# EAGLE design Lightsaber (EAGLE 9.6.2)
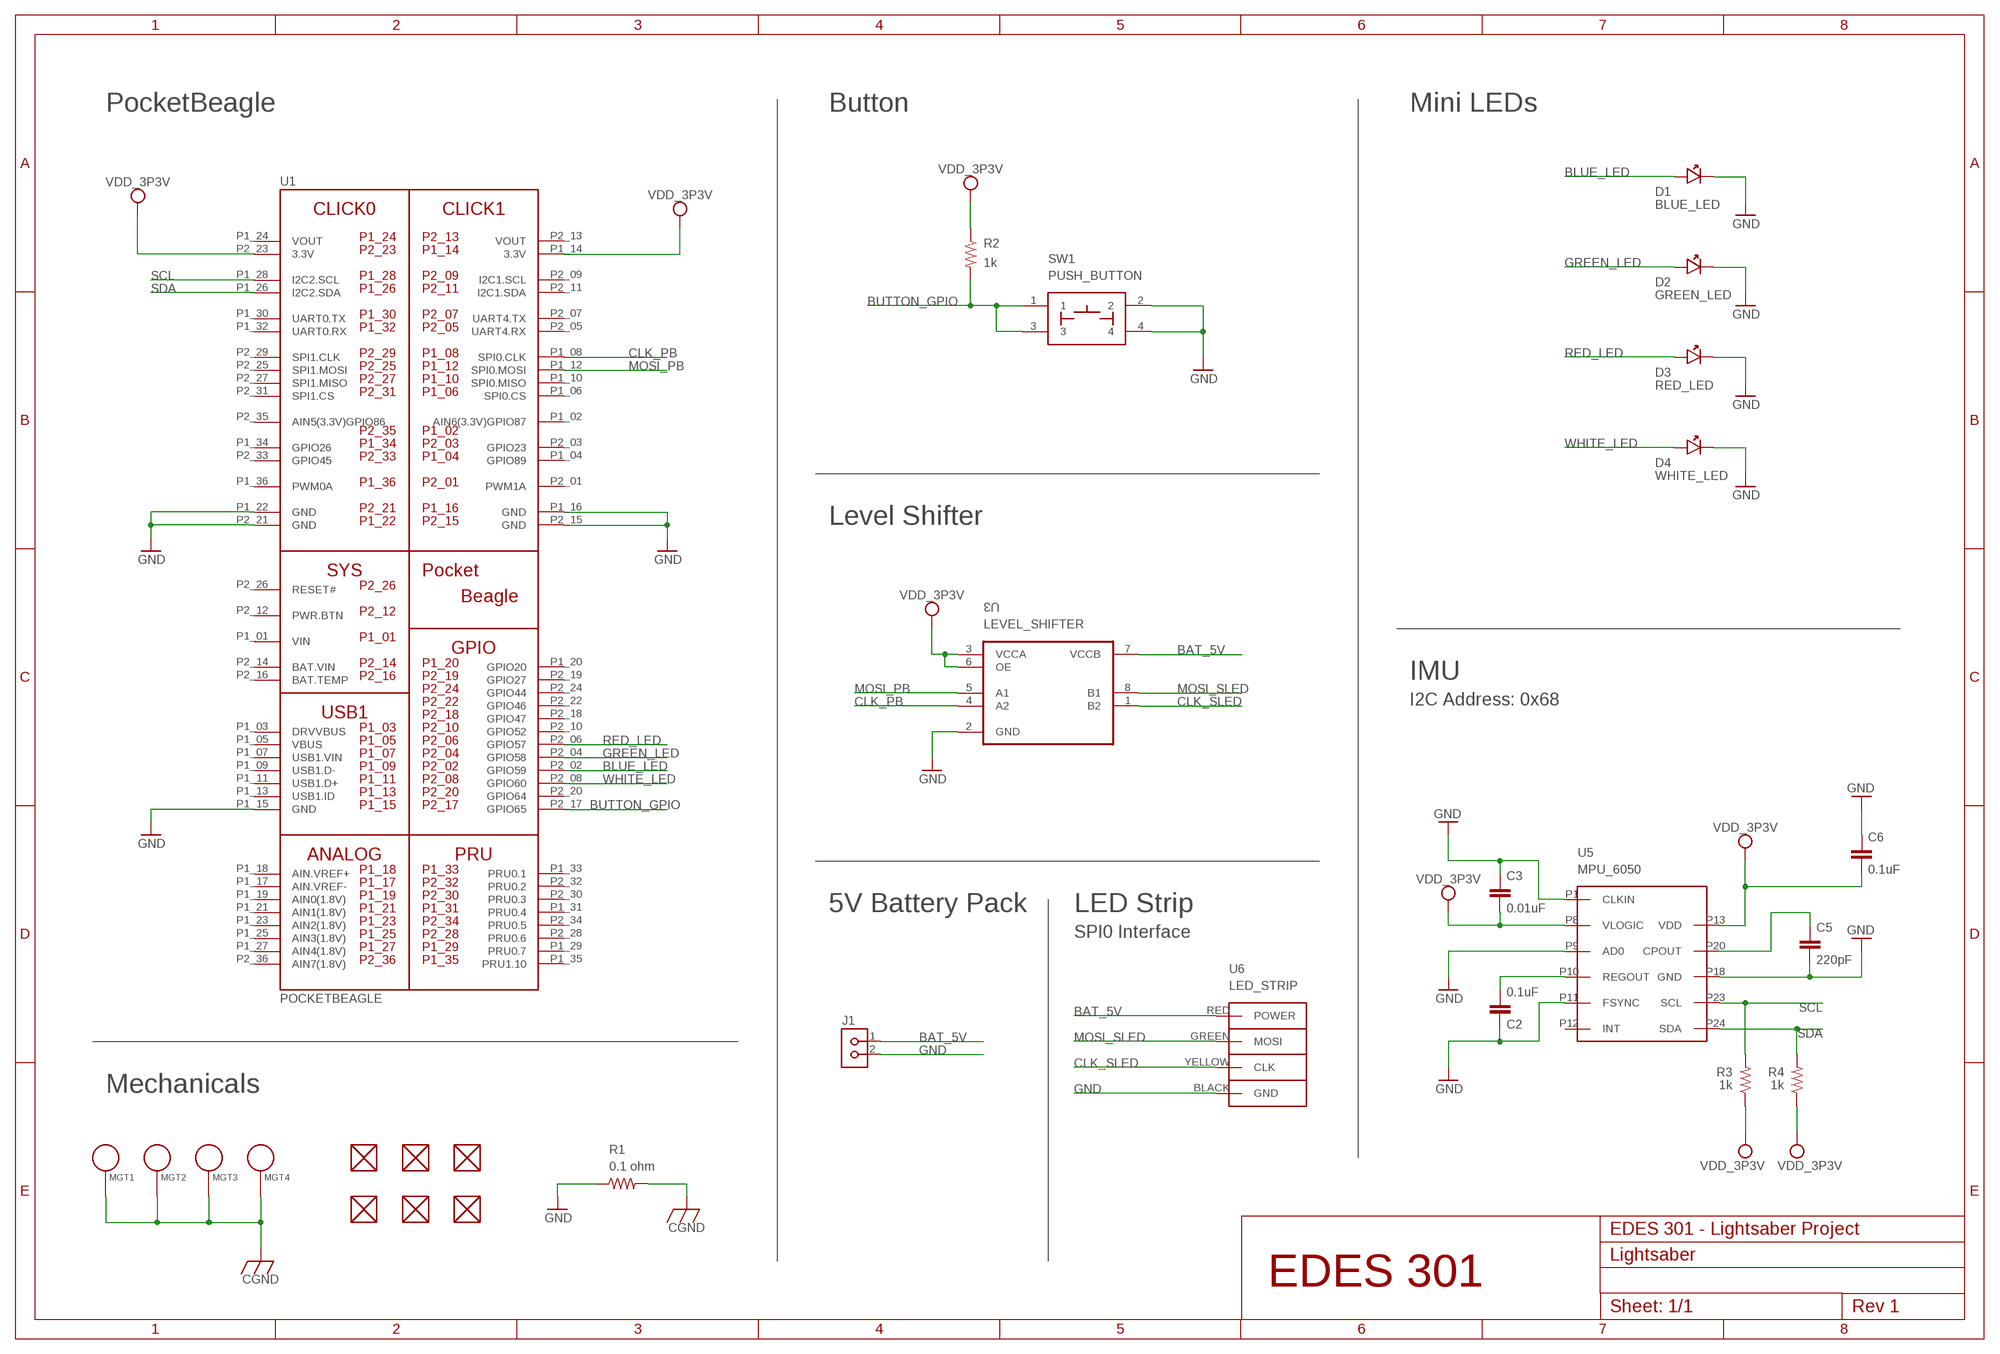
[diagram p0: schematic, sheet 1]

## Parts
C2  0.1uF  C_C0603  [C0603]
C3  0.01uF  C_C0603  [C0603]
C5  220pF  C_C0603  [C0603]
C6  0.1uF  C_C0603  [C0603]
D1  BLUE_LED  LED  [LED]
D2  GREEN_LED  LED  [LED]
D3  RED_LED  LED  [LED]
D4  WHITE_LED  LED  [LED]
FUD1  FIDUCIAL  [FIDUCIAL_40MIL]
FUD2  FIDUCIAL  [FIDUCIAL_40MIL]
FUD3  FIDUCIAL  [FIDUCIAL_40MIL]
FUD4  FIDUCIAL  [FIDUCIAL_40MIL]
FUD5  FIDUCIAL  [FIDUCIAL_40MIL]
FUD6  FIDUCIAL  [FIDUCIAL_40MIL]
J1  PINHD-1X2  [H1X2-2.54]
MGT1  MOUNTING_HOLE  [MOUNTING_HOLE]
MGT2  MOUNTING_HOLE  [MOUNTING_HOLE]
MGT3  MOUNTING_HOLE  [MOUNTING_HOLE]
MGT4  MOUNTING_HOLE  [MOUNTING_HOLE]
R1  0.1 ohm  RESISTORR0805  [R0805]
R2  1k  R_R0603  [R0603]
R3  1k  RESISTORR0603  [R0603]
R4  1k  RESISTORR0603  [R0603]
SW1  PUSH_BUTTON  [BUTTON_12.5MM]
U1  POCKETBEAGLE  [POCKETBEAGLE]
U3  LEVEL_SHIFTER  [LEVEL_SHIFTER]
U5  MPU_6050  [MPU_6050]
U6  LED_STRIP  [LED_STRIP]

## Nets
BAT_5V: J1.1 U3.7(VCCB) U6.RED(POWER)
BLUE_LED: D1.ANODE U1.P2_02(GPIO59)
BUTTON_GPIO: R2.2 SW1.1 SW1.3 U1.P2_17(GPIO65)
CGND: MGT1.P$1 MGT2.P$1 MGT3.P$1 MGT4.P$1 R1.2
CLK_PB: U1.P1_08(SPI0.CLK) U3.4(A2)
CLK_SLED: U3.1(B2) U6.YELLOW(CLK)
GND: C2.2 C3.1 C5.2 C6.1 D1.CATHODE D2.CATHODE D3.CATHODE D4.CATHODE J1.2 R1.1 SW1.2 SW1.4 U1.P1_15(GND) U1.P1_16(GND) U1.P1_22(GND) U1.P2_15(GND) U1.P2_21(GND) U3.2(GND) U5.P1(CLKIN) U5.P9(AD0) U5.P11(FSYNC) U5.P18(GND) U6.BLACK(GND)
GREEN_LED: D2.ANODE U1.P2_04(GPIO58)
MOSI_PB: U1.P1_12(SPI0.MOSI) U3.5(A1)
MOSI_SLED: U3.8(B1) U6.GREEN(MOSI)
N$3: C2.1 U5.P10(REGOUT)
N$5: C5.1 U5.P20(CPOUT)
RED_LED: D3.ANODE U1.P2_06(GPIO57)
SCL: R3.2 U1.P1_28(I2C2.SCL) U5.P23(SCL)
SDA: R4.2 U1.P1_26(I2C2.SDA) U5.P24(SDA)
VDD_3P3V: C3.2 C6.2 R2.1 R3.1 R4.1 U1.P1_14(3.3V) U1.P2_23(3.3V) U3.3(VCCA) U3.6(OE) U5.P8(VLOGIC) U5.P13(VDD)
WHITE_LED: D4.ANODE U1.P2_08(GPIO60)
Unconnected: FUD1.P$1 FUD2.P$1 FUD3.P$1 FUD4.P$1 FUD5.P$1 FUD6.P$1 U1.P1_02(AIN6(3.3V)GPIO87) U1.P1_03(DRVVBUS) U1.P1_04(GPIO89) U1.P1_05(VBUS) U1.P1_06(SPI0.CS) U1.P1_07(USB1.VIN) U1.P1_09(USB1.D-) U1.P1_10(SPI0.MISO) U1.P1_11(USB1.D+) U1.P1_13(USB1.ID) U1.P1_17(AIN.VREF-) U1.P1_18(AIN.VREF+) U1.P1_19(AIN0(1.8V)) U1.P1_20(GPIO20) U1.P1_21(AIN1(1.8V)) U1.P1_23(AIN2(1.8V)) U1.P1_25(AIN3(1.8V)) U1.P1_27(AIN4(1.8V)) U1.P1_29(PRU0.7) U1.P1_30(UART0.TX) U1.P1_31(PRU0.4) U1.P1_32(UART0.RX) U1.P1_33(PRU0.1) U1.P1_34(GPIO26) U1.P1_35(PRU1.10) U1.P1_36(PWM0A) U1.P2_01(PWM1A) U1.P2_03(GPIO23) U1.P2_05(UART4.RX) U1.P2_07(UART4.TX) U1.P2_09(I2C1.SCL) U1.P2_10(GPIO52) U1.P2_11(I2C1.SDA) U1.P2_12(PWR.BTN) U1.P2_16(BAT.TEMP) U1.P2_18(GPIO47) U1.P2_19(GPIO27) U1.P2_20(GPIO64) U1.P2_22(GPIO46) U1.P2_24(GPIO44) U1.P2_25(SPI1.MOSI) U1.P2_26(RESET#) U1.P2_27(SPI1.MISO) U1.P2_28(PRU0.6) U1.P2_29(SPI1.CLK) U1.P2_30(PRU0.3) U1.P2_31(SPI1.CS) U1.P2_32(PRU0.2) U1.P2_33(GPIO45) U1.P2_34(PRU0.5) U1.P2_35(AIN5(3.3V)GPIO86) U1.P2_36(AIN7(1.8V)) U5.P12(INT)

## Notes on the sheet
- PocketBeagle | Button | Mini LEDs
- Level Shifter
- IMU
- I2C Address: 0x68
- 5V Battery Pack | LED Strip
- SPI0 Interface
- Mechanicals
- EDES 301 - Lightsaber Project
- EDES 301
- 1/1

## Power pins joined to a net without a drawn wire
BAT.VIN: U1.P2_14(BAT.VIN)
VIN: U1.P1_01(VIN)
VOUT: U1.P1_24(VOUT) U1.P2_13(VOUT)

## Library data of the parts
C2 C3 C5 C6 = Lightsaber:C_: Capacitor SMD. Sizes: 0402, 0603 & 0805
D1-D4 = Lightsaber:LED: LTST-C191TBKT LED
FUD1-FUD6 = Lightsaber:FIDUCIAL
J1 = Lightsaber:PINHD-1X2: 2-pin 100 mil header
MGT1-MGT4 = Lightsaber:MOUNTING_HOLE: Chassis Mounting Hole w/GND connection ability
R1 R3 R4 = Lightsaber:RESISTOR: RESISTOR, American symbol
R2 = Lightsaber:R_: RESISTOR, American symbol
SW1 = Lightsaber:PUSH_BUTTON
U1 = Lightsaber:POCKETBEAGLE
U3 = Lightsaber:LEVEL_SHIFTER: Check availability <https://pricing.snapeda.com/parts/TXS0102DCTR/Texas%20Instruments/view-part?ref=eda> TXS0102DCTR; AVAILABILITY: In Stock; CHECK_PRICES: https://www.snapeda.com/parts/TXS0102DCTR/Texas+Instruments/view-part/?ref=eda; DESCRIPTION: 2-Bit Bidirectional Voltage-Level Shifter for Open-Drain and Push-Pull Application; MF: Texas Instruments; MP: TXS0102DCTR; PACKAGE: SSOP-8 Texas Instruments; PRICE: None; SNAPEDA_LINK: https://www.snapeda.com/parts/TXS0102DCTR/Texas+Instruments/view-part/?ref=snap
U5 = Lightsaber:MPU_6050: MPU 6050
U6 = Lightsaber:LED_STRIP: SK9822 LED Strip

## Board
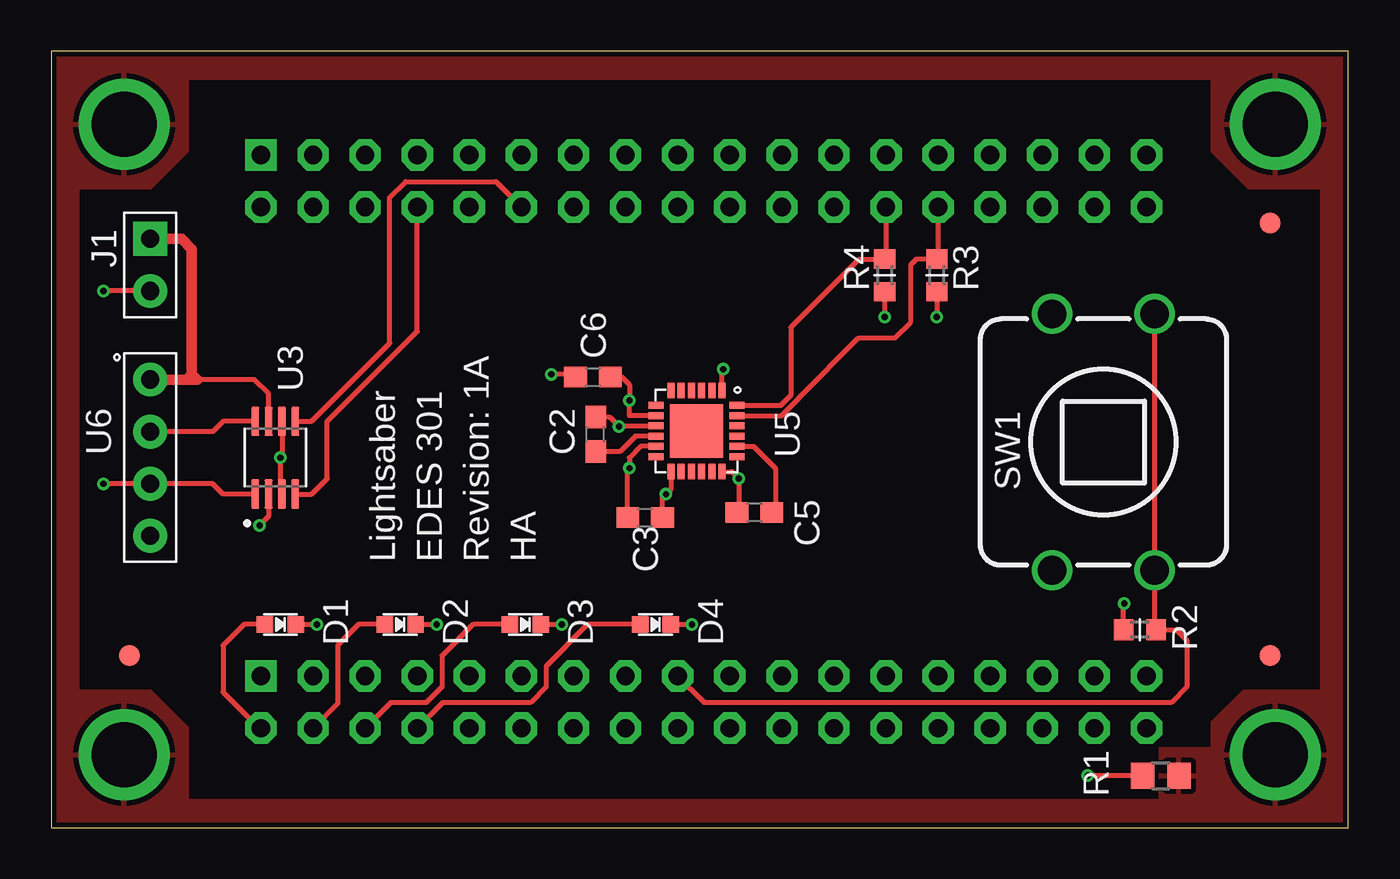
[diagram p1: board, top side]
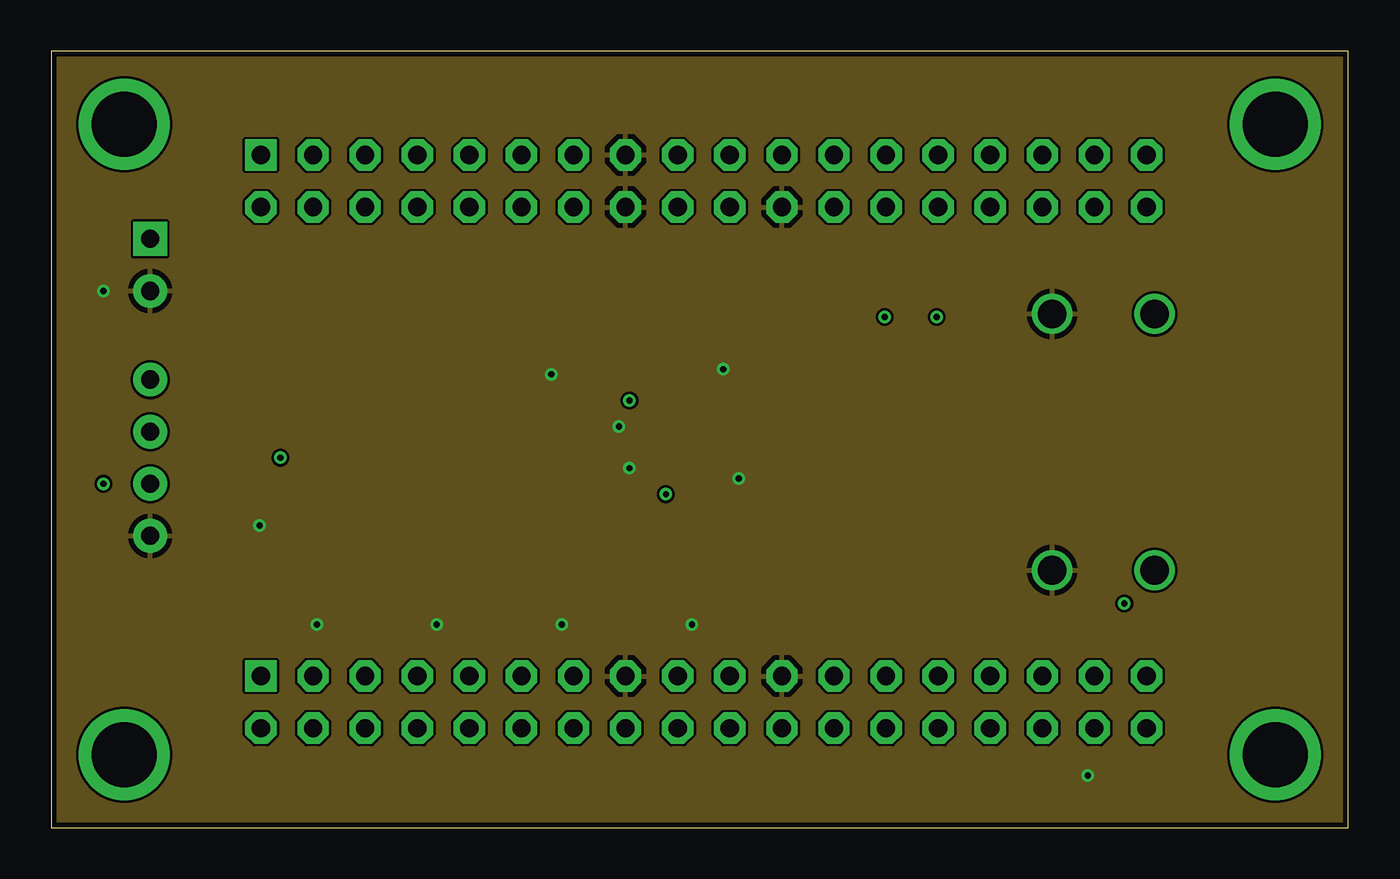
[diagram p2: board, inner layer Route2]
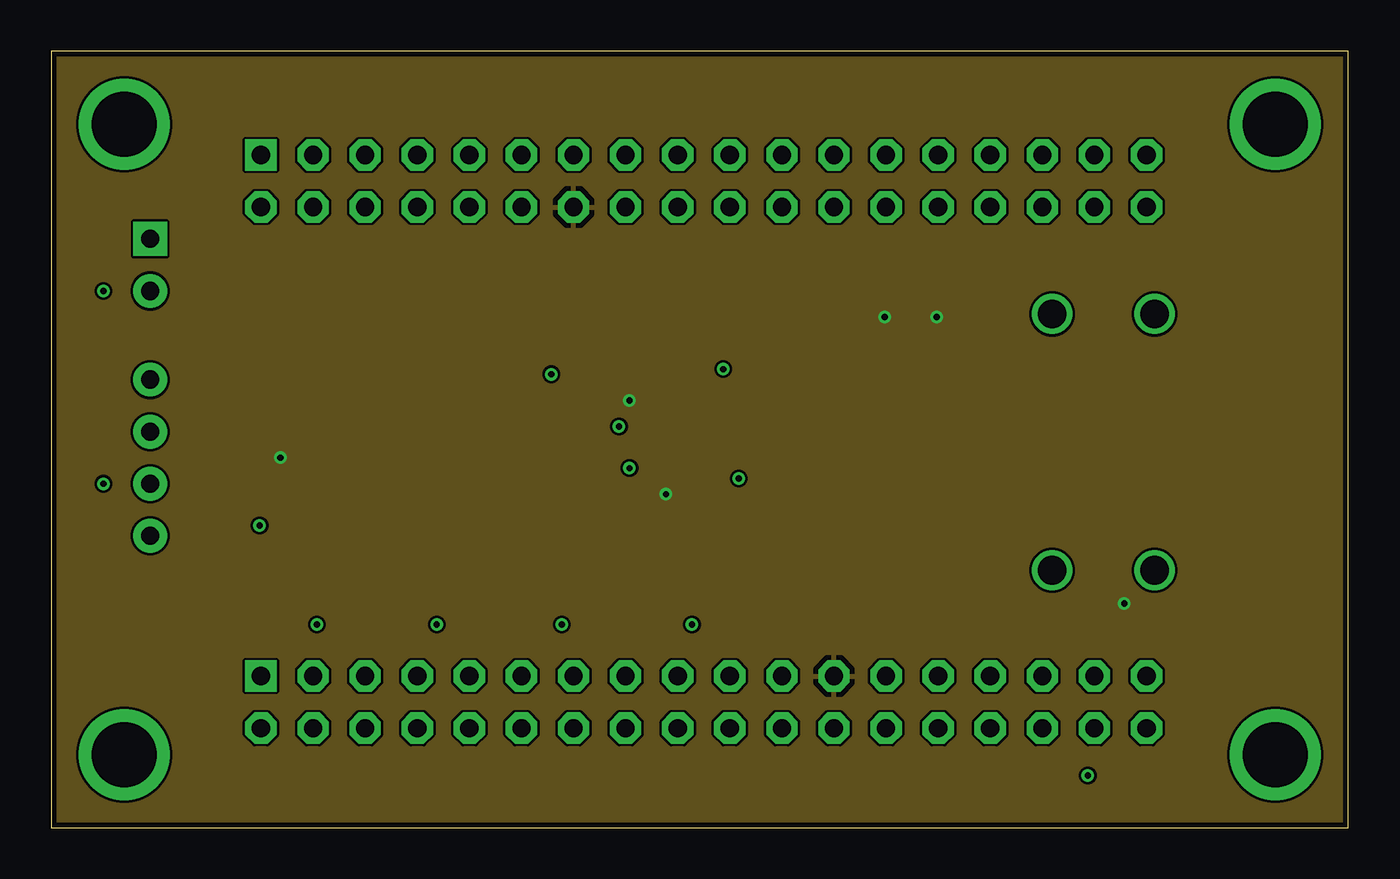
[diagram p3: board, inner layer Route15]
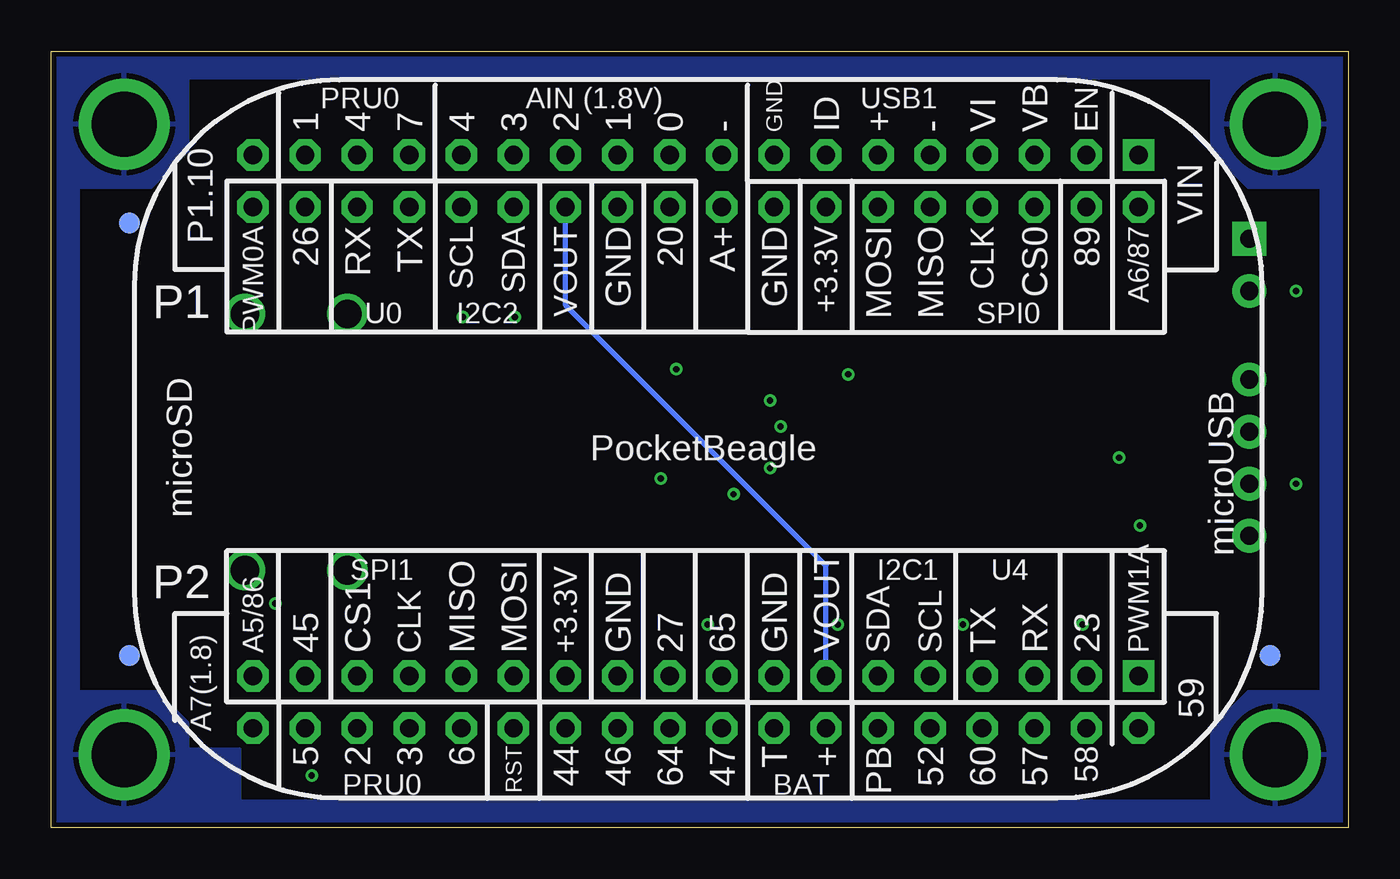
[diagram p4: board, bottom side, seen from below]

Size 63.25 x 37.85 mm. Coordinates in mm from the lower left corner, seen from the top.
Outline: 0,0 63.25,0 63.25,37.85 0,37.85 0,0
Copper layers (1*2*15*16): Top 0.035mm / dielectric 0.23mm / Route2 0.035mm / dielectric 0.93mm / Route15 0.035mm / dielectric 0.23mm / Bottom 0.035mm
Design rules "ENGI301_4lyr_5-5": minimum track width 10mil, minimum drill 12mil, track to track 5mil, track to pad 5mil, pad to pad 5mil, via to via 5mil, smd to smd 5mil, copper to edge 10mil, drill to drill 12mil, minimum pad ring 6mil, minimum via ring 6mil, stop-mask expansion 3mil, vias tented up to drill 25mil, thermal gap 10mil

### Footprints (pad centres in the part's own frame; a part is rotated, then mirrored left to right if it is on the bottom)
C0603 = smd 1.1 x 1: 1 -0.85,0; 2 0.85,0
LED = smd 0.8 x 0.8: ANODE -0.75,0; CATHODE 0.75,0
FIDUCIAL_40MIL = smd 1.016 x 1.016: P$1 0,0
H1X2-2.54 = drill 0.889 pad 1.651 square: 1 0,1.27 | drill 0.889 pad 1.651: 2 0,-1.27
MOUNTING_HOLE = drill 3.175 pad 4.445: P$1 0,0
R0805 = smd 1.143 x 1.27: 1 -0.889,0; 2 0.889,0
R0603 = smd 0.95 x 1.031: 1 -0.8,0; 2 0.8,0
BUTTON_12.5MM = drill 1.4: 1 -6.25,2.5; 2 -6.25,-2.5; 3 6.25,2.5; 4 6.25,-2.5
POCKETBEAGLE = drill 0.889 pad 1.524 square: P1_01 5.91,3.53; P2_01 5.91,28.93 | drill 0.889 pad 1.524 octagon: P1_02 5.91,6.07; P1_03 8.45,3.53; P1_04 8.45,6.07; P1_05 10.99,3.53; P1_06 10.99,6.07; P1_07 13.53,3.53; P1_08 13.53,6.07; P1_09 16.07,3.53; P1_10 16.07,6.07; P1_11 18.61,3.53; P1_12 18.61,6.07; P1_13 21.15,3.53; P1_14 21.15,6.07; P1_15 23.69,3.53; P1_16 23.69,6.07; P1_17 26.23,3.53; P1_18 26.23,6.07; P1_19 28.77,3.53; P1_20 28.77,6.07; P1_21 31.31,3.53; P1_22 31.31,6.07; P1_23 33.85,3.53; P1_24 33.85,6.07; P1_25 36.39,3.53; P1_26 36.39,6.07; P1_27 38.93,3.53; P1_28 38.93,6.07; P1_29 41.47,3.53; P1_30 41.47,6.07; P1_31 44.01,3.53; P1_32 44.01,6.07; P1_33 46.55,3.53; P1_34 46.55,6.07; P1_35 49.09,3.53; P1_36 49.09,6.07; P2_02 5.91,31.47; P2_03 8.45,28.93; P2_04 8.45,31.47; P2_05 10.99,28.93; P2_06 10.99,31.47; P2_07 13.53,28.93; P2_08 13.53,31.47; P2_09 16.07,28.93; P2_10 16.07,31.47; P2_11 18.61,28.93; P2_12 18.61,31.47; P2_13 21.15,28.93; P2_14 21.15,31.47; P2_15 23.69,28.93; P2_16 23.69,31.47; P2_17 26.23,28.93; P2_18 26.23,31.47; P2_19 28.77,28.93; P2_20 28.77,31.47; P2_21 31.31,28.93; P2_22 31.31,31.47; P2_23 33.85,28.93; P2_24 33.85,31.47; P2_25 36.39,28.93; P2_26 36.39,31.47; P2_27 38.93,28.93; P2_28 38.93,31.47; P2_29 41.47,28.93; P2_30 41.47,31.47; P2_31 44.01,28.93; P2_32 44.01,31.47; P2_33 46.55,28.93; P2_34 46.55,31.47; P2_35 49.09,28.93; P2_36 49.09,31.47
LEVEL_SHIFTER = smd 1.42 x 0.4: 1 -1.77,0.975; 2 -1.77,0.325; 3 -1.77,-0.325; 4 -1.77,-0.975; 5 1.77,-0.975; 6 1.77,-0.325; 7 1.77,0.325; 8 1.77,0.975
MPU_6050 = smd 0.75 x 0.35: P1 0.025,3.25; P2 0.025,2.75; P3 0.025,2.25; P4 0.025,1.75; P5 0.025,1.25; P6 0.025,0.75; P13 3.975,0.75; P14 3.975,1.25; P15 3.975,1.75; P16 3.975,2.25; P17 3.975,2.75; P18 3.975,3.25 | smd 0.35 x 0.75: P7 0.75,0.025; P8 1.25,0.025; P9 1.75,0.025; P10 2.25,0.025; P11 2.75,0.025; P12 3.25,0.025; P19 3.25,3.975; P20 2.75,3.975; P21 2.25,3.975; P22 1.75,3.975; P23 1.25,3.975; P24 0.75,3.975 | smd 2.6 x 2.6: PAD 2,2
LED_STRIP = drill 0.889 pad 1.651: BLACK 0,-5.08; GREEN 0,0; RED 0,2.54; YELLOW 0,-2.54

### Placement (x,y rotation side)
C2  26.54,19.18 90 top
C3  28.96,15.11 0 top
C5  34.29,15.37 180 top
C6  26.42,21.97 0 top
D1  11.18,9.91 0 top
D2  17.02,9.91 0 top
D3  23.11,9.91 0 top
D4  29.46,9.91 0 top
FUD1  59.44,8.38 0 top
FUD2  59.44,29.46 0 bottom
FUD3  59.44,8.38 0 bottom
FUD4  3.81,8.38 0 bottom
FUD5  3.81,8.38 0 top
FUD6  59.44,29.46 0 top
J1  4.83,27.43 0 top
MGT1  3.56,34.29 0 top
MGT2  3.56,3.56 0 top
MGT3  59.69,3.56 0 top
MGT4  59.69,34.29 0 top
R1  54.1,2.54 0 top
R2  53.09,9.65 0 top
R3  43.18,26.92 90 top
R4  40.64,26.92 90 top
SW1  51.31,18.8 270 top
U1  4.32,36.32 180 bottom
U3  10.92,18.03 90 top
U5  29.46,21.34 270 top
U6  4.83,19.3 0 top

### Tracks (layer width: path | path; a pad name or v marks a point on that pad's centre or on a via)
BAT_5V
  Top 0.254: U3.7 10.6,21.15 9.91,21.84 7.11,21.84
  Top 0.508: U6.RED 6.6,21.84 | 6.6,21.84 6.86,22.1 | J1.1 6.35,28.7 6.86,28.19 6.86,22.1 | 6.86,22.1 7.11,21.84 6.6,21.84
BLUE_LED
  Top 0.254: D1.ANODE 9.4,9.91 8.38,8.89 8.38,6.6 10.13,4.85 U1.P2_02
BUTTON_GPIO
  Top 0.254: SW1.1 SW1.3 53.81,9.73 R2.2 54.86,9.65 55.37,9.14 55.37,6.86 54.61,6.1 31.84,6.1 U1.P2_17
CGND
  pour Top: 1.27,19.05 1.27,31.24 4.83,31.24 6.6,33.02 6.6,36.58 56.64,36.58 56.64,33.02 58.42,31.24 61.98,31.24 61.98,19.56 64.52,19.56 64.52,39.12 -1.27,39.12 -1.27,19.05
  pour Bottom: -1.27,39.12 -1.27,19.05 1.27,19.05 1.27,31.24 4.83,31.24 6.6,33.02 6.6,36.58 56.64,36.58 56.64,33.02 58.42,31.24 61.98,31.24 61.98,19.56 64.52,19.56 64.52,39.12
  pour Bottom: 64.52,19.56 61.98,19.56 61.98,6.6 58.17,6.6 56.64,5.08 56.64,3.81 54.1,3.81 54.1,1.27 6.6,1.27 6.6,4.83 4.83,6.6 1.27,6.6 1.27,19.05 -1.27,19.05 -1.27,-1.27 64.52,-1.27
  pour Top: 64.52,19.56 61.98,19.56 61.98,6.6 58.17,6.6 56.64,5.08 56.64,3.81 54.1,3.81 54.1,1.27 6.6,1.27 6.6,4.83 4.83,6.6 1.27,6.6 1.27,19.05 -1.27,19.05 -1.27,-1.27 64.52,-1.27
CLK_PB
  Top 0.254: U3.4 12.69,16.26 12.7,16.26 13.46,17.02 13.46,19.81 17.85,24.2 U1.P1_08
CLK_SLED  (via drill 0.3 pad 0.61)
  Top 0.254: U3.1 8.37,16.26 7.87,16.76 U6.YELLOW v2.54,16.76
GND  (via drill 0.3 pad 0.61)
  Top 0.254: U5.P11 28.75,18.59 28.19,18.03 v28.19,17.53 28.11,17.44 C3.1 | U5.P9 27.71,19.59 v27.69,19.56 27.22,20.03 C2.2 | C6.1 25.44,22.1 v24.38,22.1 | D4.CATHODE v31.24,9.91 | D3.CATHODE v24.89,9.91 | D2.CATHODE v18.8,9.91 | D1.CATHODE v12.95,9.91 | U3.2 10.6,15.17 v10.16,14.73 | R1.1 v50.55,2.54 | U5.P18 33.19,17.36 v33.53,17.02 33.53,15.46 C5.2 | U5.P1 32.71,22.3 v32.77,22.35 | J1.2 v2.54,26.16
  pour Route2 (rank 6): -5.08,-5.08 -5.08,43.18 68.58,43.18 68.58,-5.08
GREEN_LED
  Top 0.254: D2.ANODE 14.99,9.91 13.97,8.89 13.97,6.05 U1.P2_04
MOSI_PB
  Top 0.254: U3.5 11.9,19.81 12.7,19.81 16.51,23.62 16.51,30.73 17.27,31.5 21.68,31.5 U1.P1_12
MOSI_SLED
  Top 0.254: U3.8 8.37,19.8 7.87,19.3 U6.GREEN
N$3
  Top 0.254: U5.P10 28.48,19.09 27.73,18.33 C2.1
N$5
  Top 0.254: U5.P20 34.25,18.59 35.31,17.53 35.31,15.53 C5.1
RED_LED
  Top 0.254: D3.ANODE 20.57,9.91 19.05,8.38 19.05,6.86 18.29,6.1 16.55,6.1 U1.P2_06
SCL
  Top 0.254: U1.P1_28 43.25,27.79 R3.2 42.2,27.72 41.91,27.43 41.91,24.64 41.15,23.88 39.37,23.88 36.45,20.95 36.45,20.92 35.61,20.09 U5.P23
SDA
  Top 0.254: U1.P1_26 40.71,27.79 R4.2 40.6,27.69 39.37,27.69 36.07,24.38 36.07,21.08 35.56,20.57 33.45,20.57 U5.P24
VDD_3P3V  (via drill 0.3 pad 0.61)
  Top 0.254: U5.P8 28.19,20.09 v28.19,20.83 28.19,21.59 27.81,21.97 C6.2 | U3.6 11.25,18.11 v11.18,18.03 11.18,16.34 U3.3 | U5.P13 30.21,16.5 v29.97,16.26 29.81,16.09 C3.2 | R4.1 v40.64,24.89 | R3.1 v43.18,24.89 | R2.1 52.29,10.88 v52.32,10.92
  pour Route15 (rank 6): -7.62,-7.62 -7.62,45.72 72.39,45.72 72.39,-7.62
VOUT
  Bottom 0.254: U1.P2_13 25.47,12.77 38.17,25.47 U1.P1_24
WHITE_LED
  Top 0.254: D4.ANODE 26.16,9.91 24.13,7.87 24.13,6.86 23.37,6.1 19.09,6.1 U1.P2_08

### Text on the board
tPlace: Lightsaber | EDES 301 | Revision: 1A | HA